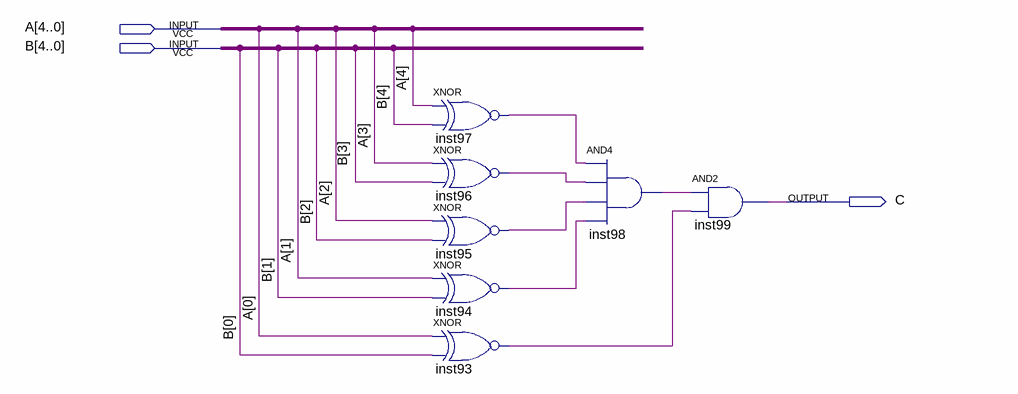
[diagram p0: schematic sheet]
// Quartus schematic equals_comparator.bdf as structural Verilog: 7 symbols, 3 pins
module equals_comparator (
  input  [4:0] A,
  input  [4:0] B,
  output C
);

  wire inst93_out, inst94_out, inst95_out, inst96_out, inst97_out, inst98_out;

  xnor inst97 (inst97_out, A[4], B[4]);
  xnor inst96 (inst96_out, A[3], B[3]);
  xnor inst95 (inst95_out, A[2], B[2]);
  xnor inst94 (inst94_out, A[1], B[1]);
  xnor inst93 (inst93_out, A[0], B[0]);
  and inst98 (inst98_out, inst97_out, inst96_out, inst95_out, inst94_out);
  and inst99 (C, inst98_out, inst93_out);
endmodule
